# EAGLE design SmartSwitch (EAGLE 7.1.0)
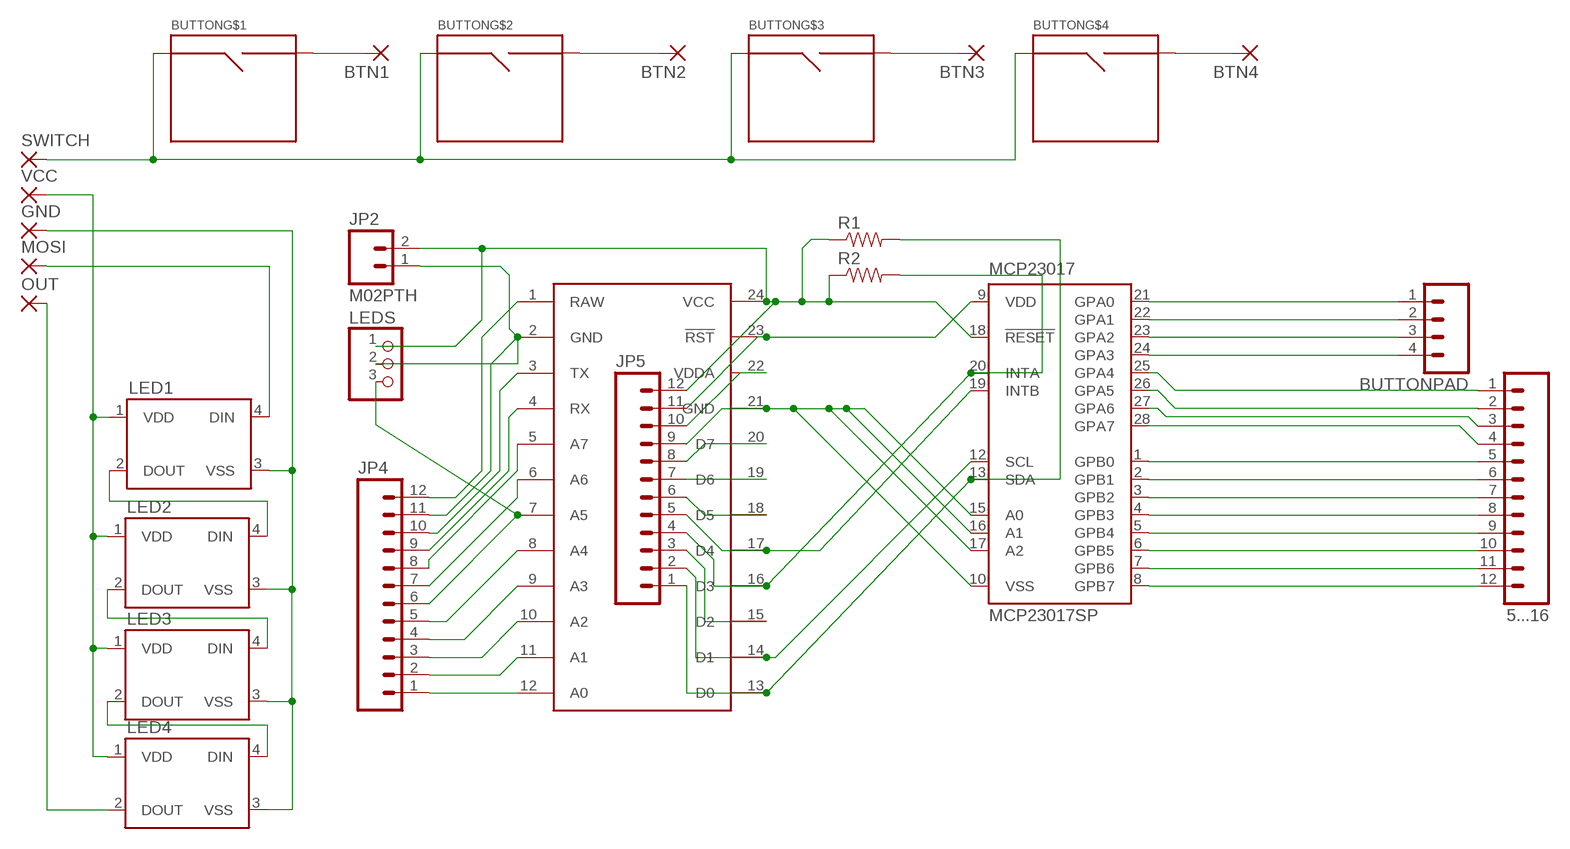
[diagram p0: schematic, sheet 1]

## Parts
5...16  M12PTH  [1X12]
BTN1  2,15/1,0  [2,15/1,0]
BTN2  2,15/1,0  [2,15/1,0]
BTN3  2,15/1,0  [2,15/1,0]
BTN4  2,15/1,0  [2,15/1,0]
BUTTON  BUTTON  [BUTTON]
BUTTONPAD  M04PTH  [1X04]
GND  2,15/1,0  [2,15/1,0]
JP2  M02PTH  [1X02]
JP4  M12PTH  [1X12-SMALL-PADS]
JP5  M12PTH  [1X12-SMALL-PADS]
LED1  WS2812B  [WS2812B]
LED2  WS2812B  [WS2812B]
LED3  WS2812B  [WS2812B]
LED4  WS2812B  [WS2812B]
LEDS  PINHD-1X3  [1X03]
MCP23017  MCP23017SP  [DIL28-3]
MOSI  2,15/1,0  [2,15/1,0]
OUT  2,15/1,0  [2,15/1,0]
R1  RESISTORPTH-1/2W  [AXIAL-0.5]
R2  RESISTORPTH-1/2W  [AXIAL-0.5]
SPARK  SPARK_CORECORE  [SPARK_CORE]
SWITCH  2,15/1,0  [2,15/1,0]
VCC  2,15/1,0  [2,15/1,0]

## Nets
GROUND: GND.1(P) LED1.3(VSS) LED2.3(VSS) LED3.3(VSS) LED4.3(VSS)
MOSI: LED1.4(DIN) MOSI.1(P)
N$1: BTN1.1(P) BUTTON.SIG2
N$2: BTN2.1(P) BUTTON.SIG4(SIG2)
N$3: BTN3.1(P) BUTTON.SIG6(SIG2)
N$4: BTN4.1(P) BUTTON.SIG8(SIG2)
N$5: BUTTONPAD.1 MCP23017.21(GPA0)
N$6: BUTTONPAD.2 MCP23017.22(GPA1)
N$7: BUTTONPAD.3 MCP23017.23(GPA2)
N$8: BUTTONPAD.4 MCP23017.24(GPA3)
N$9: LED4.2(DOUT) OUT.1(P)
N$10: LED1.1(VDD) LED2.1(VDD) LED3.1(VDD) LED4.1(VDD) VCC.1(P)
N$11: LED1.2(DOUT) LED2.4(DIN)
N$12: LED2.2(DOUT) LED3.4(DIN)
N$13: LED3.2(DOUT) LED4.4(DIN)
N$14: 5...16.1 MCP23017.25(GPA4)
N$15: 5...16.2 MCP23017.26(GPA5)
N$16: 5...16.3 MCP23017.27(GPA6)
N$17: 5...16.4 MCP23017.28(GPA7)
N$18: 5...16.5 MCP23017.1(GPB0)
N$19: 5...16.6 MCP23017.2(GPB1)
N$20: 5...16.7 MCP23017.3(GPB2)
N$21: 5...16.8 MCP23017.4(GPB3)
N$22: 5...16.9 MCP23017.5(GPB4)
N$23: 5...16.10 MCP23017.6(GPB5)
N$24: 5...16.11 MCP23017.7(GPB6)
N$25: 5...16.12 MCP23017.8(GPB7)
N$26: JP5.3 SPARK.15(D2)
N$27: JP5.5 MCP23017.19(INTB) SPARK.17(D4)
N$28: JP2.2 JP5.12 LEDS.1 MCP23017.18(!RESET) R1.P$1 R2.P$1 SPARK.24(VCC)
N$29: JP4.6 LEDS.3 SPARK.7(A5)
N$30: JP2.1 JP4.11 LEDS.2 SPARK.2(GND)
N$31: JP4.1 SPARK.12(A0)
N$32: JP5.9 MCP23017.10(VSS) MCP23017.15(A0) MCP23017.16(A1) MCP23017.17(A2) SPARK.21(GND)
N$33: JP5.2 MCP23017.12(SCL) SPARK.14(D1)
N$34: JP5.1 MCP23017.13(SDA) R1.P$2 SPARK.13(D0)
N$35: JP4.2 SPARK.11(A1)
N$36: JP4.3 SPARK.10(A2)
N$37: JP4.4 SPARK.9(A3)
N$38: JP4.5 SPARK.8(A4)
N$39: JP4.7 SPARK.6(A6)
N$40: JP4.8 SPARK.5(A7)
N$41: JP4.9 SPARK.4(RX)
N$42: JP4.10 SPARK.3(TX)
N$43: JP5.6 SPARK.18(D5)
N$44: JP4.12 SPARK.1(RAW)
N$46: JP5.8 SPARK.20(D7)
N$47: JP5.7 SPARK.19(D6)
N$48: JP5.10 SPARK.22(VDDA)
N$49: JP5.11 MCP23017.9(VDD) SPARK.23(!RST)
N$50: BUTTON.SIG1 BUTTON.SIG3(SIG1) BUTTON.SIG5(SIG1) BUTTON.SIG7(SIG1) SWITCH.1(P)
N$51: JP5.4 MCP23017.20(INTA) R2.P$2 SPARK.16(D3)

## Library data of the parts
5...16 = SparkFun-Connectors:M12: Header 12 Standard 12-pin 0.1" header. Use with straight break away headers (SKU : PRT-00116), right angle break away headers (PRT-00553), swiss pins (PRT-00743), machine pins (PRT-00117), and female headers (PRT-00115).
BTN1-BTN4 GND MOSI OUT SWITCH VCC = wirepad:2,15/1,0: THROUGH-HOLE PAD
BUTTON = TestLibrary:BUTTON
BUTTONPAD = SparkFun-Connectors:M04: Header 4 Standard 4-pin 0.1" header. Use with straight break away headers (SKU : PRT-00116), right angle break away headers (PRT-00553), swiss pins (PRT-00743), machine pins (PRT-00117), and female headers (PRT-00115). Molex polarized connector foot print use with SKU : PRT-08231 with associated crimp pins and housings. 1MM SMD Version SKU: PRT-10208
JP2 = SparkFun-Connectors:M02: Standard 2-pin 0.1" header. Use with - straight break away headers ( PRT-00116) - right angle break away headers (PRT-00553) - swiss pins (PRT-00743) - machine pins (PRT-00117) - female headers (PRT-00115) Molex polarized connector foot print use with: PRT-08233 with associated crimp pins and housings. 2.54_SCREWTERM for use with PRT-10571. 3.5mm Screw Terminal footprints for PRT-08084 5mm Screw Terminal footprints for use with PRT-08432
JP4 JP5 = Spark:M12: Header 12 Standard 12-pin 0.1" header. Use with straight break away headers (SKU : PRT-00116), right angle break away headers (PRT-00553), swiss pins (PRT-00743), machine pins (PRT-00117), and female headers (PRT-00115).
LED1-LED4 = SparkFun-LED:WS2812B: WS2812B - Intelligent control LED integrated light source Technical Specifications: Power Supply Voltage (VDD): 3.5 to 5.3 V Input Voltage (VI): -0.5 to VDD+0.5 V Operating Junction Temperature (Topt): -25°C to +80°C Storage Temperature Range (Tstg): -55°C to +150°C
LEDS = adafruit:PINHD-1X3: PIN HEADER
MCP23017 = adafruit:MCP23017: http://ww1.microchip.com/downloads/en/DeviceDoc/21952a.pdf Source: http://ww1.microchip.com/downloads/en/DeviceDoc/21952a.pdf
R1 R2 = SparkFun-Passives:RESISTOR: Resistor Basic schematic elements and footprints for 0603, 1206, and PTH resistors.
SPARK = Spark:SPARK_CORE

## Board
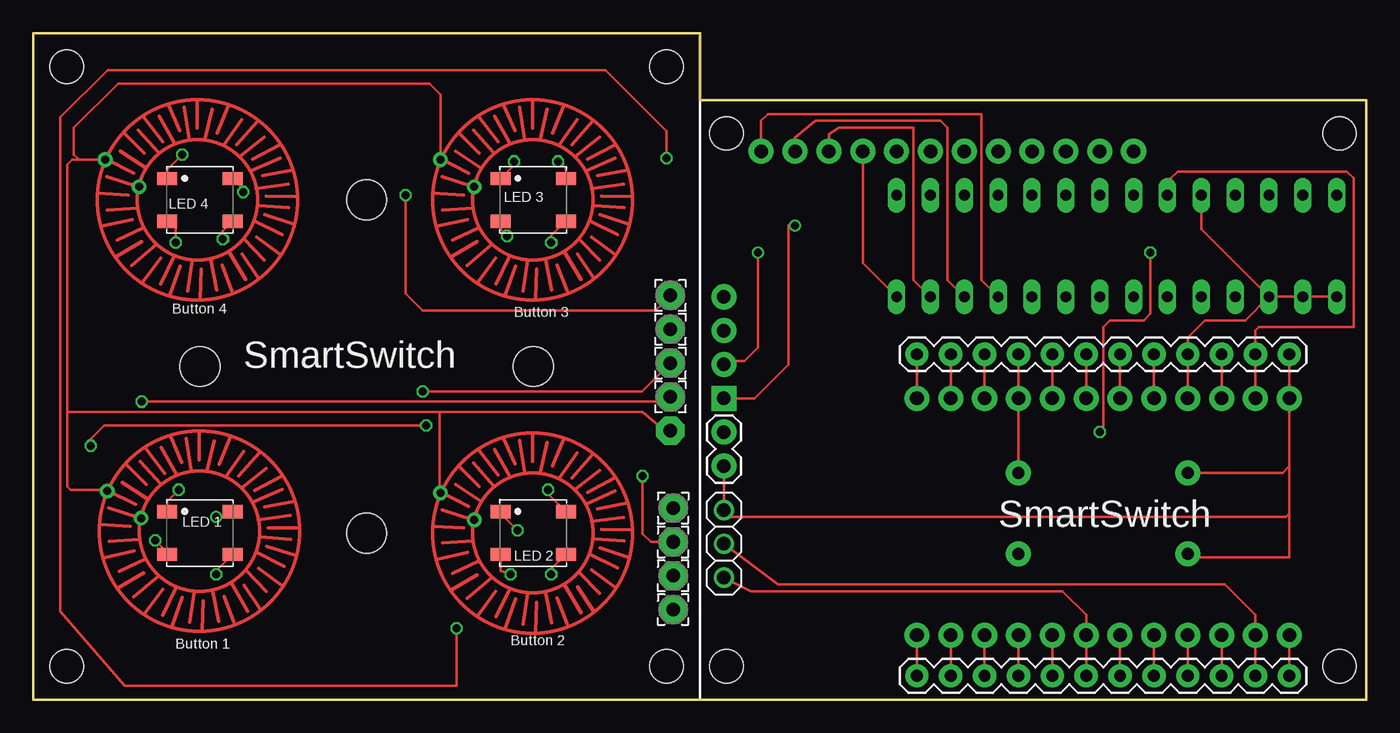
[diagram p1: board, top side]
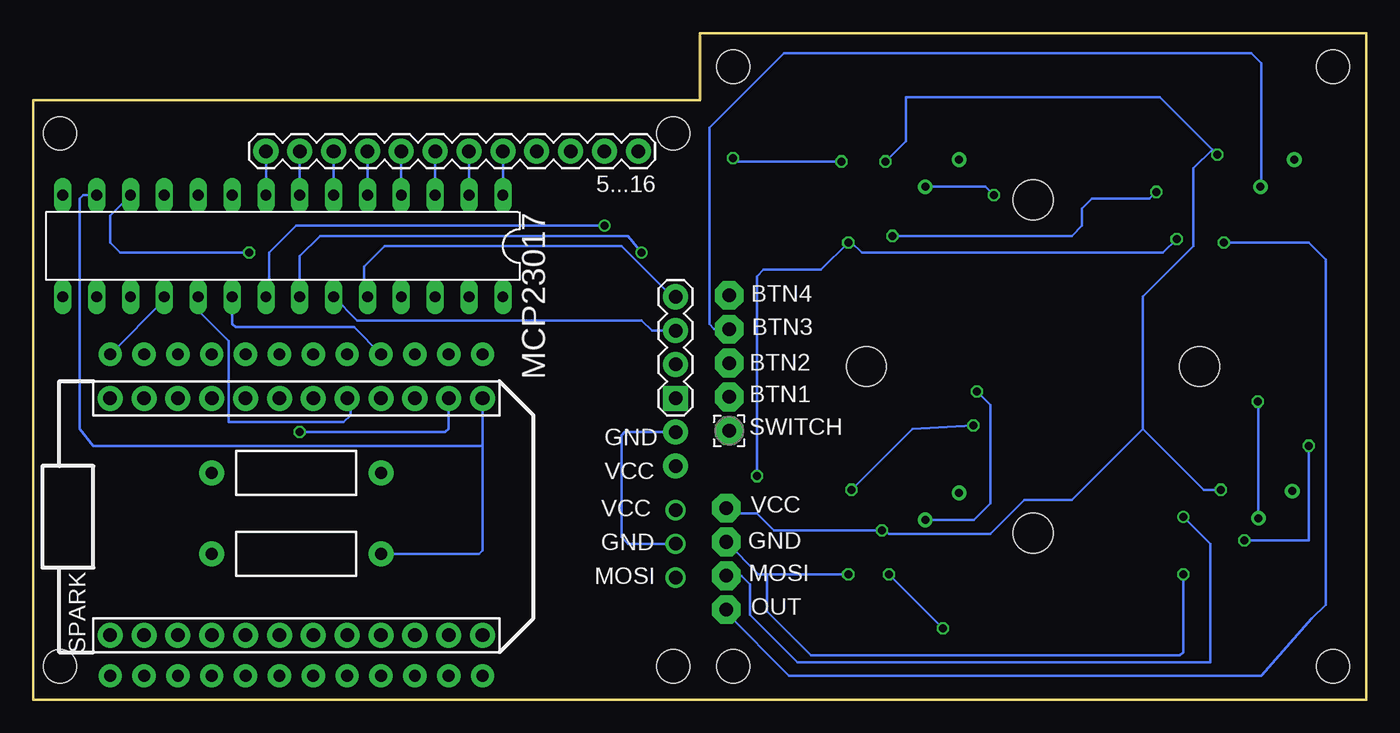
[diagram p2: board, bottom side, seen from below]

Size 100 x 50 mm. Coordinates in mm from the lower left corner, seen from the top.
Outline: 50,50 50,45 100,45 100,0 0,0 0,50 50,50
Copper layers (1*16): Top 0.035mm / dielectric 1.5mm / Bottom 0.035mm
Design rules "ITEADstudio_DRC": minimum track width 6mil, minimum drill 12mil, track to track 6mil, track to pad 6mil, pad to pad 6mil, via to via 6mil, smd to smd 0mil, copper to edge 10mil, drill to drill 10mil, minimum pad ring 10mil, minimum via ring 6mil, stop-mask expansion 2mil, vias tented up to drill 100mil, thermal gap 10mil
Holes 3 mm at 12.5,25 25,37.5 37.5,25 25,12.5
Holes 2.5 mm at 2.5,2.5 2.5,47.5 47.5,47.5 47.5,2.5 98,42.5 98,2.5 52,42.5 52,2.5

### Footprints (pad centres in the part's own frame; a part is rotated, then mirrored left to right if it is on the bottom)
1X12 = drill 1.016 pad 1.88: 1 0,0; 2 2.54,0; 3 5.08,0; 4 7.62,0; 5 10.16,0; 6 12.7,0; 7 15.24,0; 8 17.78,0; 9 20.32,0; 10 22.86,0; 11 25.4,0; 12 27.94,0
2,15/1,0 = drill 1.016 pad 2.159 octagon: 1 0,0
BUTTON = drill 0.6: SIG1 5.542,15.64; SIG2 8.082,13.608; SIG3 30.542,15.513; SIG4 33.082,13.481; SIG5 5.388,40.513; SIG6 7.928,38.481; SIG7 30.542,40.513; SIG8 33.082,38.481
1X04 = drill 1.016 pad 1.88 square: 1 0,0 | drill 1.016 pad 1.88: 2 2.54,0; 3 5.08,0; 4 7.62,0
1X02 = drill 1.016 pad 1.88: 1 0,0; 2 2.54,0
1X12-SMALL-PADS = drill 0.889 pad 1.753: 1 0,0; 2 2.54,0; 3 5.08,0; 4 7.62,0; 5 10.16,0; 6 12.7,0; 7 15.24,0; 8 17.78,0; 9 20.32,0; 10 22.86,0; 11 25.4,0; 12 27.94,0
WS2812B = smd 1.5 x 1: 1 -2.45,1.6; 2 -2.45,-1.6; 3 2.45,-1.6; 4 2.45,1.6
1X03 = drill 1.016: 1 -2.54,0; 2 0,0; 3 2.54,0
DIL28-3 = drill 0.813 long: 1 -16.51,-3.81; 2 -13.97,-3.81; 3 -11.43,-3.81; 4 -8.89,-3.81; 5 -6.35,-3.81; 6 -3.81,-3.81; 7 -1.27,-3.81; 8 1.27,-3.81; 9 3.81,-3.81; 10 6.35,-3.81; 11 8.89,-3.81; 12 11.43,-3.81; 13 13.97,-3.81; 14 16.51,-3.81; 15 16.51,3.81; 16 13.97,3.81; 17 11.43,3.81; 18 8.89,3.81; 19 6.35,3.81; 20 3.81,3.81; 21 1.27,3.81; 22 -1.27,3.81; 23 -3.81,3.81; 24 -6.35,3.81; 25 -8.89,3.81; 26 -11.43,3.81; 27 -13.97,3.81; 28 -16.51,3.81
AXIAL-0.5 = drill 0.9 pad 1.88: P$1 -6.35,0; P$2 6.35,0
SPARK_CORE = drill 1.016 pad 1.88: 1 -8.89,13.97; 2 -8.89,11.43; 3 -8.89,8.89; 4 -8.89,6.35; 5 -8.89,3.81; 6 -8.89,1.27; 7 -8.89,-1.27; 8 -8.89,-3.81; 9 -8.89,-6.35; 10 -8.89,-8.89; 11 -8.89,-11.43; 12 -8.89,-13.97; 13 8.89,-13.97; 14 8.89,-11.43; 15 8.89,-8.89; 16 8.89,-6.35; 17 8.89,-3.81; 18 8.89,-1.27; 19 8.89,1.27; 20 8.89,3.81; 21 8.89,6.35; 22 8.89,8.89; 23 8.89,11.43; 24 8.89,13.97

### Placement (x,y rotation side)
5...16  54.61,41.15 180 bottom
BTN1  47.79,22.71 90 top
BTN2  47.79,25.25 90 top
BTN3  47.79,27.79 90 top
BTN4  47.79,30.33 90 top
BUTTON  0,0 0 top
BUTTONPAD  51.82,22.61 90 bottom
GND  48.01,11.83 270 top
JP2  51.82,20.07 270 top
JP4  66.29,1.78 0 top
JP5  66.29,25.91 0 top
LED1  12.5,12.5 0 top
LED2  37.5,12.5 0 top
LED3  37.5,37.5 0 top
LED4  12.5,37.5 0 top
LEDS  51.82,11.68 270 top
MCP23017  81.28,34.04 180 bottom
MOSI  48.01,9.29 270 top
OUT  48.01,6.75 270 top
R1  80.26,10.92 0 bottom
R2  80.26,17.02 0 bottom
SPARK  80.26,13.72 90 bottom
SWITCH  47.79,20.17 180 bottom
VCC  48.01,14.37 90 top

### Tracks (layer width: path | path; a pad name or v marks a point on that pad's centre or on a via)
GROUND  (via drill 0.6)
  Top 0.203: LED1.3 13.72,9.67 v13.72,9.4 | LED2.3 38.86,9.81 v38.86,9.4 | LED3.3 38.86,34.81 v38.86,34.29 | v45.72,16.76 45.72,12.45 46.34,11.83 GND.1 | LED4.3 14.22,35.17 v14.22,34.54
  Bottom 0.203: GND.1 45.58,9.4 44.96,9.4 | 44.96,9.4 v38.86,9.4 | v13.72,9.4 13.72,3.56 13.97,3.3 41.66,3.3 44.96,6.6 44.96,9.4 | v45.72,16.76 45.72,31.75 45.21,32.26 40.89,32.26 v38.86,34.29 38.61,34.29 37.85,33.53 15.24,33.53 v14.22,34.54
MOSI  (via drill 0.6)
  Top 0.203: v13.72,13.72 14.57,13.72 LED1.4
  Bottom 0.203: 47.9,9.29 MOSI.1 46.88,9.29 46.23,8.64 46.23,6.35 42.67,2.79 11.68,2.79 11.68,11.68 v13.72,13.72
N$1  (via drill 0.6)
  Top 0.203: BTN1.1 46.92,22.35 v8.13,22.35
  Bottom 0.203: v8.13,22.35 8.08,21.8 BUTTON.SIG2
N$2  (via drill 0.6)
  Top 0.203: BTN2.1 45.65,23.11 v29.21,23.11
  Bottom 0.203: v29.21,23.11 28.19,22.1 28.19,14.73 29.45,13.48 BUTTON.SIG4
N$3
  Bottom 0.203: BUTTON.SIG6 7.87,38.53 7.87,47.75 8.64,48.51 43.69,48.51 49.28,42.93 49.28,28.19 48.91,27.79 BTN3.1
N$4  (via drill 0.6)
  Top 0.203: BTN4.1 46.67,29.21 29.21,29.21 27.94,30.48 v27.94,37.85
  Bottom 0.203: v27.94,37.85 28.57,38.48 BUTTON.SIG8
N$5  (via drill 0.6)
  Top 0.203: BUTTONPAD.1 54.1,22.61 56.64,25.15 56.64,35.56 v57.15,35.56
  Bottom 0.203: v57.15,35.56 80.26,35.56 82.3,33.53 82.3,30.48 MCP23017.21
N$6  (via drill 0.6)
  Top 0.203: v54.36,33.53 54.36,26.42 53.34,25.4 52.07,25.4 BUTTONPAD.2
  Bottom 0.203: MCP23017.22 80.01,33.27 78.49,34.8 55.37,34.8 v54.36,33.53
N$7
  Bottom 0.203: BUTTONPAD.3 53.59,27.69 54.36,28.45 75.69,28.45 MCP23017.23
N$8
  Bottom 0.203: BUTTONPAD.4 52.07,30.23 55.88,34.04 73.66,34.04 75.18,32.51 75.18,30.48 MCP23017.24
N$9  (via drill 0.6)
  Top 0.203: v10.67,34.29 10.67,35.81 10.58,35.9 LED4.2
  Bottom 0.203: v10.67,34.29 4.32,34.29 3.05,33.02 3.05,7.11 4.06,6.1 7.87,1.78 43.29,1.78 48.01,6.5 OUT.1
N$10  (via drill 0.6)
  Top 0.203: LED4.1 10.05,39.77 v11.18,40.89 | v36.07,40.39 36.07,40.12 LED3.1 | LED1.1 10.05,14.88 v10.92,15.75 | v36.32,12.7 35.05,13.97 LED2.1
  Bottom 0.203: v11.18,40.89 11.56,41.27 | 11.56,41.27 15.49,45.21 34.54,45.21 34.54,41.91 v36.07,40.39 | 11.56,41.27 12.95,39.88 12.95,34.04 16.76,30.23 16.76,20.32 | 16.76,20.32 12.19,15.75 v10.92,15.75 | VCC.1 47.61,13.97 45.72,13.97 44.45,12.7 v36.32,12.7 36.07,12.7 35.81,12.45 28.19,12.45 25.65,14.99 22.1,14.99 16.76,20.32
N$11  (via drill 0.6)
  Top 0.203: LED2.4 38.61,15.44 v38.61,15.75 | v29.46,20.57 5.33,20.57 4.32,19.56 v4.32,19.05 | v9.14,11.94 10.05,11.03 LED1.2
  Bottom 0.203: v38.61,15.75 34.04,20.32 v29.46,20.57 | v4.32,19.05 4.32,11.94 v9.14,11.94
N$12  (via drill 0.6)
  Top 0.203: v47.5,40.64 47.5,42.67 42.93,47.24 5.59,47.24 2.03,43.69 2.03,6.6 6.86,1.02 31.75,1.02 v31.75,5.33 | v39.37,40.39 39.95,39.81 LED3.4 | v35.81,9.4 35.05,9.65 LED2.2
  Bottom 0.203: v47.5,40.64 47.24,40.39 v39.37,40.39 | v31.75,5.33 v35.81,9.4
N$13  (via drill 0.6)
  Top 0.203: LED4.4 15.75,38.3 v15.75,38.1 | v35.56,34.8 35.05,35.31 LED3.2
  Bottom 0.203: v15.75,38.1 16.26,37.59 20.57,37.59 21.34,36.83 21.34,35.56 22.1,34.8 v35.56,34.8
N$14
  Top 0.203: MCP23017.25 71.12,31.5 71.12,43.94 55.12,43.94 54.61,43.43 5...16.1
N$15
  Top 0.203: MCP23017.26 68.58,31.5 68.58,42.93 68.07,43.43 58.67,43.43 57.15,42.16 5...16.2
N$16
  Top 0.203: MCP23017.27 66.04,31.5 66.04,42.93 60.45,42.93 59.69,42.42 5...16.3
N$17
  Top 0.203: MCP23017.28 62.23,32.77 5...16.4
N$18
  Bottom 0.203: 5...16.5 MCP23017.1
N$19
  Bottom 0.203: 5...16.6 MCP23017.2
N$20
  Bottom 0.203: 5...16.7 MCP23017.3
N$21
  Bottom 0.203: 5...16.8 MCP23017.4
N$22
  Bottom 0.203: 5...16.9 MCP23017.5
N$23
  Bottom 0.203: 5...16.10 MCP23017.6
N$24
  Bottom 0.203: 5...16.11 MCP23017.7
N$25
  Bottom 0.203: 5...16.12 MCP23017.8
N$26
  Top 0.203: SPARK.15 JP5.3
N$27
  Top 0.203: SPARK.17 JP5.5
  Bottom 0.203: MCP23017.19 87.63,29.21 85.34,26.92 85.34,20.83 76.71,20.83 76.2,21.34 76.2,22.35 SPARK.17
N$28
  Top 0.203: JP5.12 SPARK.24 94.23,17.53 | JP2.2 LEDS.1 52.32,13.72 93.98,13.72 94.23,13.97 | 94.23,17.53 93.73,17.02 R2.P$1 | 94.23,13.97 94.23,17.53 | R1.P$1 86.87,10.67 94.23,10.67 94.23,13.97
  Bottom 0.203: JP5.12 90.17,29.97 MCP23017.18
N$29
  Top 0.203: JP4.6 SPARK.7 78.99,6.35 77.22,8.13 53.85,8.13 LEDS.3
N$30
  Top 0.203: JP4.11 SPARK.2 91.69,6.35 89.41,8.64 55.88,8.64 LEDS.2
  Bottom 0.203: LEDS.2 55.37,11.68 55.88,12.19 55.88,19.81 55.63,20.07 JP2.1
N$31
  Top 0.203: SPARK.12 JP4.1
N$32
  Top 0.203: JP5.9 SPARK.21 86.61,27.18 87.88,28.45 90.93,28.45 MCP23017.17 | MCP23017.17 MCP23017.16 MCP23017.15 | MCP23017.17 87.63,35.31 MCP23017.10
N$33  (via drill 0.6)
  Top 0.203: SPARK.14 JP5.2 | v83.82,33.53 83.82,28.96 83.31,28.45 80.77,28.45 80.26,27.94 80.26,20.32 v80.01,20.07
  Bottom 0.203: MCP23017.12 94.23,36.32 94.23,34.29 93.47,33.53 v83.82,33.53 | SPARK.14 68.83,20.32 69.09,20.07 v80.01,20.07
N$34
  Top 0.203: JP5.1 SPARK.13
  Bottom 0.203: SPARK.13 66.29,19.05 | 66.29,19.05 95.5,19.05 96.52,20.32 96.52,37.59 96.27,37.85 MCP23017.13 | 66.29,19.05 66.29,11.18 66.55,10.92 R1.P$2
N$35
  Top 0.203: SPARK.11 JP4.2
N$36
  Top 0.203: SPARK.10 JP4.3
N$37
  Top 0.203: SPARK.9 JP4.4
N$38
  Top 0.203: SPARK.8 JP4.5
N$39
  Top 0.203: SPARK.6 JP4.7
N$40
  Top 0.203: SPARK.5 JP4.8
N$41
  Top 0.203: SPARK.4 JP4.9
N$42
  Top 0.203: SPARK.3 JP4.10
N$43
  Top 0.203: JP5.6 SPARK.18
N$44
  Top 0.203: SPARK.1 JP4.12
N$46
  Top 0.203: JP5.8 SPARK.20
N$47
  Top 0.203: JP5.7 SPARK.19
N$48
  Top 0.203: JP5.10 SPARK.22
N$49
  Top 0.203: SPARK.23 JP5.11 91.69,27.69 91.95,27.94 99.06,27.94 99.06,39.12 98.55,39.62 85.85,39.62 85.34,39.12 85.34,38.1 MCP23017.9
N$50
  Top 0.203: SWITCH.1 47.39,20.17 45.72,21.59 30.48,21.59 | 30.48,21.59 30.48,15.57 BUTTON.SIG3 | 2.54,21.59 30.48,21.59 | BUTTON.SIG7 30.54,45.4 29.72,46.23 6.35,46.23 3.05,42.93 3.05,40.89 3.43,40.51 | BUTTON.SIG5 3.43,40.51 | BUTTON.SIG1 5.43,15.75 2.79,15.75 2.54,16 2.54,21.59 | 2.54,21.59 2.54,40.13 2.92,40.51 3.43,40.51
N$51
  Top 0.203: JP5.4 SPARK.16 R2.P$2
  Bottom 0.203: JP5.4 75.95,27.94 84.84,27.94 85.09,28.19 MCP23017.20

### Text on the board
tNames: LED 4 | LED 3 | Button 4 | Button 3 | SmartSwitch | LED 1 | SmartSwitch | LED 2 | Button 1 | Button 2
bNames: GND | VCC | VCC | GND | MOSI